# Altium schematic sheet PyNab_Power.SchDoc: PyNab - Power
size A4; CompanyName: Enero; DrawnBy: Enero; Engineer: Hugo Balette-pape; Organization: ENERO; Address1: 7, rue ambroise thomas; Address2: 75009; Address3: Paris; Address4: France; Revision: 2.0; SheetNumber: 1; SheetTotal: 4
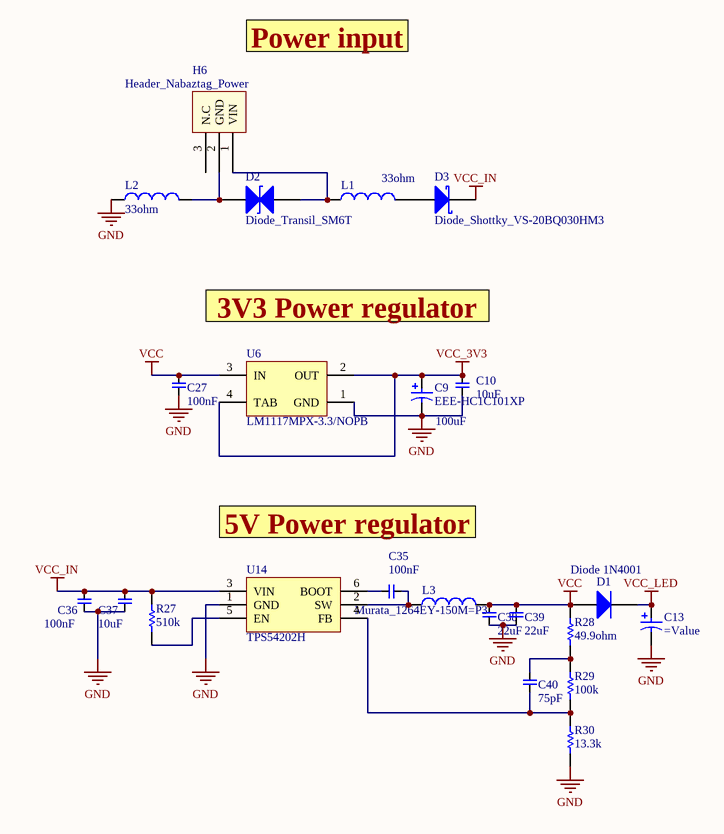
[diagram p0: PyNab_Power.SchDoc]

## Parts
C9  EEE-HC1C101XP  value 100uF  [EEE-HC1C101XP]
C10  10uF  [CAP0603]
C13  (no value)  [CAPAE6083X105M]
C27  100nF  [CAP0603]
C35  100nF  [CAP0603]
C36  100nF  [CAP0603]
C37  10uF  [CAP0603]
C38  22uF  [CAP0603]
C39  22uF  [CAP0603]
C40  75pF  [CAP0603]
D1  Diode 1N4001  [DO-41]
D2  Diode_Transil_SM6T  [Diode_Transil_SM6T]
D3  Diode_Shottky_VS-20BQ030HM3  [Diode_Shottky_VS-20BQ030HM3]
H6  Header_Nabaztag_Power  [HDR3x1_Nabaztag_pwr]
L1  33ohm  [IND0603]
L2  33ohm  [IND0603]
L3  Murata_1264EY-150M=P3  [Murata-1264EY-150M=P3]
R27  510k  [RES0603]
R28  49.9ohm  [RES0603]
R29  100k  [RES0603]
R30  13.3k  [RES0603]
U6  LM1117MPX-3.3/NOPB  [MP04A_N]
U14  TPS54202H  [SOT95P280X110-6N]

## Nets
GND: C9.1(K) C10.1 C13.2(K) C27.1 C36.1 C37.1 C38.1 C39.1 L2.2 R30.1 U6.1(GND) U14.1(GND)
VCC: C27.2 C38.2 C39.2 D1.1(A) L3.2 R28.2 U6.3(IN)
VCC_3V3: C9.2(A) C10.2 U6.2(OUT) U6.4(TAB)
VCC_IN: C36.2 C37.2 D3.1(K) R27.1 U14.3(VIN)
VCC_LED: C13.1(A) D1.2(K)
NetC35_1: C35.1 L3.1 U14.2(SW)
NetC35_2: C35.2 U14.6(BOOT)
NetC40_1: C40.1 R28.1 R29.2
NetC40_2: C40.2 R29.1 R30.2 U14.4(FB)
NetD2_1: D2.1 H6.2(GND) L2.1
NetD2_2: D2.2 H6.1(VIN) L1.2
NetD3_2: D3.2(A) L1.1
NetR27_2: R27.2 U14.5(EN)

Not connected (* = marked no-connect by the designer): H6 3(N.C)

## Notes on the sheet
- Power input
- 3V3 Power regulator
- 5V Power regulator
- Title
- Size:
- Date:
- A4
- Number:
- Time:
- Revision:
- Sheet
- of
- File:

## Library data of the parts
C9 = VS0608 pol cap electro SMT
C10 C27 C35-C40 = Capacitor_np: Non-polarised capacitor
  C10 C37: Value: 10uF
  C27 C35 C36: Value: 100nF
  C38 C39: Value: 22uF
  C40: Value: 75pF
C13 = Capacitor_pol: Polarised capacitor
D1 = Diode 1N4001: 1 Amp General Purpose Rectifier; Published: 8-Jun-2000; LatestRevisionDate: 17-Jul-2002; LatestRevisionNote: Re-released for DXP Platform.; DatasheetVersion: 1998; PackageVersion: Aug-1999; PackageReference: DO-41; Publisher: Altium Limited; PackageDescription: Diode, Axial; Body 5.2 x 2.7 mm (LxDia. max), Lead Dia. 0.86 mm (max); Code_JEDEC: DO-204-AL; ComponentLink1Description: Manufacturer Link; ComponentLink1URL: http://www.fairchildsemi.com/; ComponentLink2Description: Datasheet; ComponentLink2URL: http://www.fairchildsemi.com/ds/1N%2F1N4001.pdf
H6 = Header_Nabaztag_Power: Power Header
L1 L2 = Inductor1: Inductor 0603 blm18pg330sn; Value: 33ohm
L3 = Inductor1: Inductor; Value: =Value
R27-R30 = Resistor1: Resistor
  R27: Value: 510k
  R28: Value: 49.9ohm
  R29: Value: 100k
  R30: Value: 13.3k
U6 = LM1117MPX-3.3/NOPB: 800mA Low-Dropout Linear Regulator, 4-pin SOT-223, Pb-Free; Manufacturer: National Semiconductor; PackageTopMarking: XYTT*N05A; PowerWise: N; CompType: LDO IC; High-Reliability: Y; DatasheetVersion: Apr-2006; PackageVersion: revB, Apr-2003; PackageReference: MP04A; PackageDescription: Molded SOT-223, 6.50 x 3.56 x 1.6mm Body, 4 Lead, 2.3mm Pitch; PartNumber: LM1117MPX-3.3/NOPB; RoHS: Y; PinCount: 4; Code_JEDEC: TO-261-AA; Code_IPC: SOT223-4; ComponentLink1Description: Manufacturer URL; ComponentLink1URL: http://www.national.com/; ComponentLink2Description: LM1117 Datasheet; ComponentLink2URL: http://www.national.com/ds/LM/LM1117.pdf; ComponentLink3Description: LM1117 Web Page; ComponentLink3URL: http://www.national.com/pf/LM/LM1117.html; ComponentLink4Description: MP04A Package Page; ComponentLink4URL: http://www.national.com/packaging/folders/mp04a.html